# Altium schematic sheet Cover.SchDoc
size A; SheetNumber: 1; SheetTotal: 6
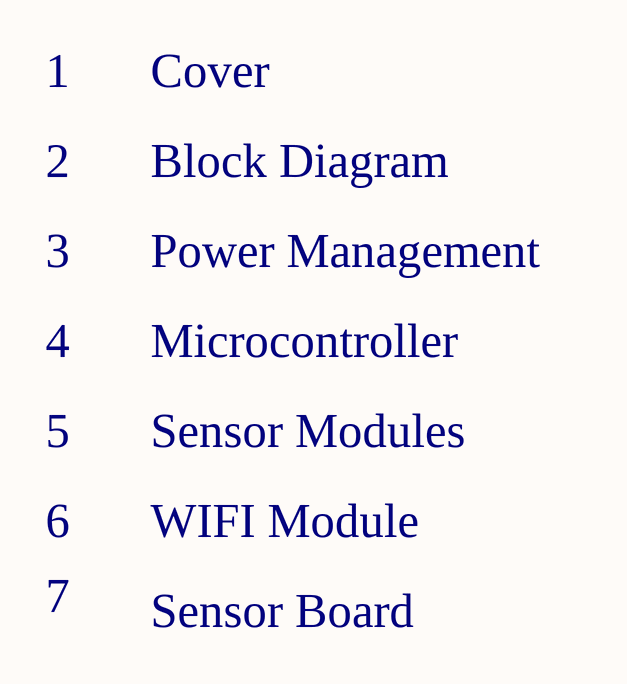
[diagram p0: Cover.SchDoc]

## Notes on the sheet
- 1
- Cover
- 2
- 3
- Block Diagram
- Power Management
- 4
- 5
- Microcontroller
- Sensor Modules
- 6
- WIFI Module
- 7
- Sensor Board